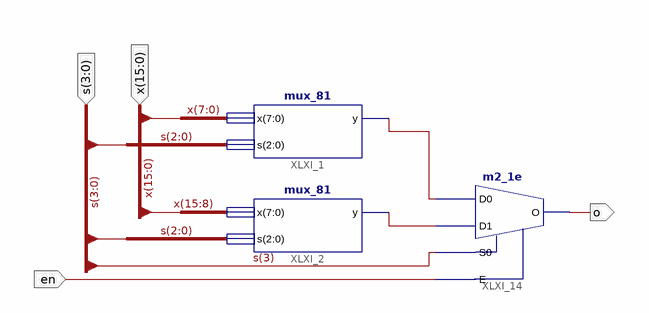
[diagram p0: schematic sheet 1]
// Xilinx ISE schematic mux_16_1.sch (spartan3e) as structural Verilog: 3 symbols, 4 ports
module mux_16_1 (
  input  [15:0] x,
  input  [3:0] s,
  input  en,
  output o
);

  wire XLXN_39, XLXN_51;

  mux_81 XLXI_2 (.x(x[15:8]), .s(s[2:0]), .y(XLXN_51));
  mux_81 XLXI_1 (.x(x[7:0]), .s(s[2:0]), .y(XLXN_39));
  m2_1e XLXI_14 (.D0(XLXN_39), .D1(XLXN_51), .E(en), .S0(s[3]), .O(o));
endmodule
